# EAGLE design 2mm-2.5mm (EAGLE 4.16)
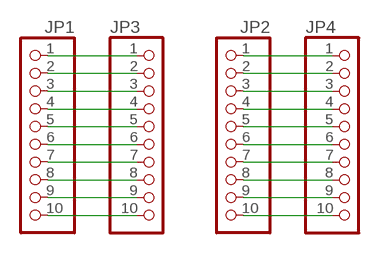
[diagram p0: schematic, sheet 1]

## Parts
JP1  PINHD-1X10  [1X10]
JP2  PINHD-1X10  [1X10]
JP3  PINHD-1X10M  [1X10M]
JP4  PINHD-1X10M  [1X10M]

## Nets
N$1: JP1.1 JP3.1
N$2: JP1.2 JP3.2
N$3: JP1.3 JP3.3
N$4: JP1.4 JP3.4
N$5: JP1.5 JP3.5
N$6: JP1.6 JP3.6
N$7: JP1.7 JP3.7
N$8: JP1.8 JP3.8
N$9: JP1.9 JP3.9
N$10: JP1.10 JP3.10
N$11: JP2.1 JP4.1
N$12: JP2.2 JP4.2
N$13: JP2.3 JP4.3
N$14: JP2.4 JP4.4
N$15: JP2.5 JP4.5
N$16: JP2.6 JP4.6
N$17: JP2.7 JP4.7
N$18: JP2.8 JP4.8
N$19: JP2.9 JP4.9
N$20: JP2.10 JP4.10

## Library data of the parts
JP1 JP2 = pinhead:PINHD-1X10: PIN HEADER
JP3 JP4 = pinhead-new:PINHD-1X10: PIN HEADER

## Board
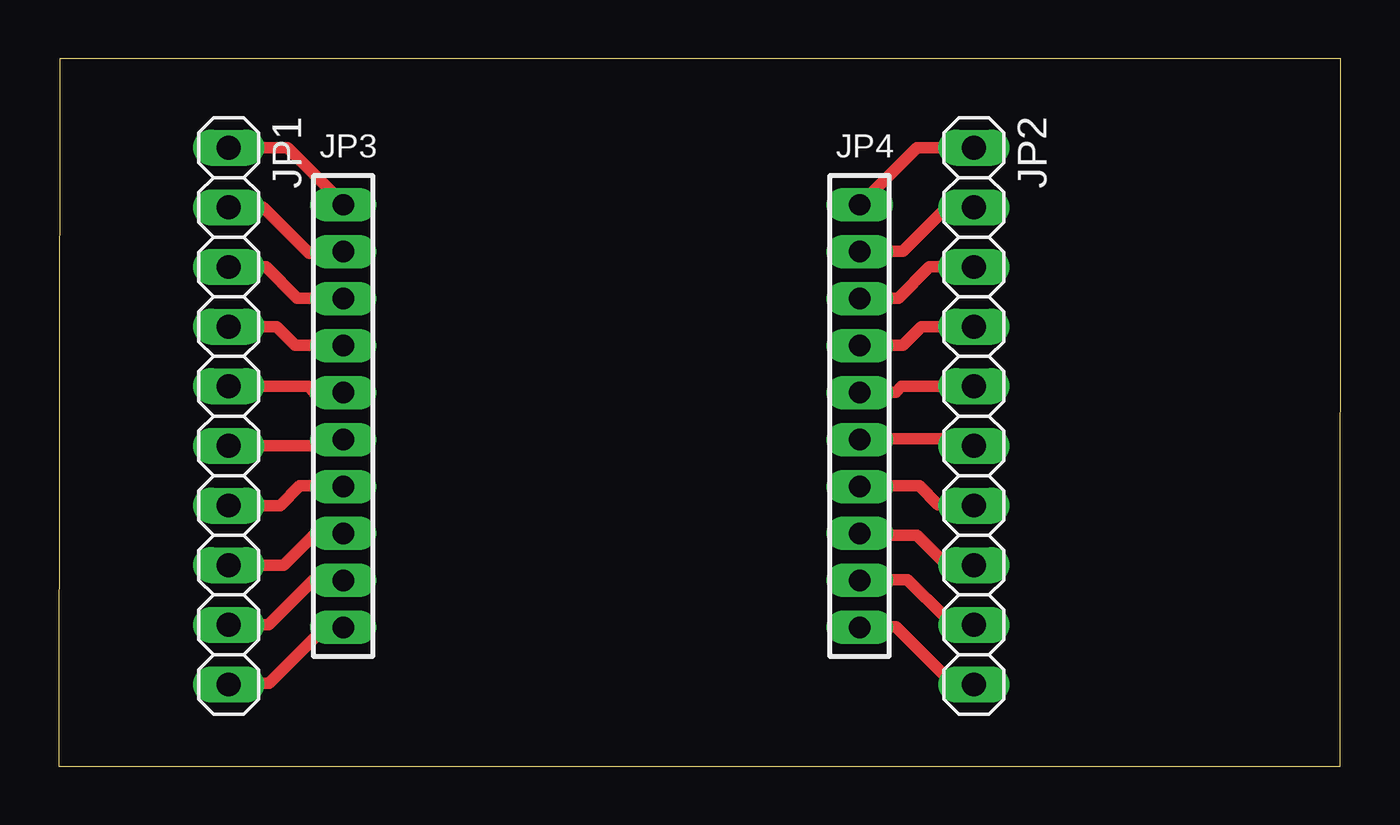
[diagram p1: board, top side]

Size 54.62 x 30.12 mm. Coordinates in mm from the lower left corner, seen from the top.
Outline: 0,0 54.6,0 54.62,30.12 0.05,30.12 0,0
Copper layers (1*16): Top 0.035mm / dielectric 1.5mm / Bottom 0.035mm
Design rules "default": minimum track width 10mil, minimum drill 24mil, track to track 8mil, track to pad 8mil, pad to pad 8mil, via to via 8mil, smd to smd 8mil, copper to edge 40mil, drill to drill 8mil, minimum pad ring 10mil, minimum via ring 8mil, stop-mask expansion 4mil, vias tented up to drill 0mil, thermal gap 10mil

### Footprints (pad centres in the part's own frame; a part is rotated, then mirrored left to right if it is on the bottom)
1X10 = drill 1.016 long: 1 -11.43,0; 2 -8.89,0; 3 -6.35,0; 4 -3.81,0; 5 -1.27,0; 6 1.27,0; 7 3.81,0; 8 6.35,0; 9 8.89,0; 10 11.43,0
1X10M = drill 0.914 long: 1 -9,0; 2 -7,0; 3 -5,0; 4 -3,0; 5 -1,0; 6 1,0; 7 3,0; 8 5,0; 9 7,0; 10 9,0

### Placement (x,y rotation side)
JP1  7.25,14.91 270 top
JP2  38.99,14.91 270 top
JP3  12.12,14.91 270 top
JP4  34.12,14.91 270 top

### Tracks (layer width: path | path; a pad name or v marks a point on that pad's centre or on a via)
N$1
  Top 0.4: 12.17,23.93 12.15,23.9 JP3.1
  Top 0.5: JP1.1 9.77,26.33 12.17,23.93
N$2
  Top 0.4: JP3.2 12.1,21.9 12.07,21.93 11.97,21.83
  Top 0.5: JP1.2 8.71,23.79 10.67,21.83 11.97,21.83
N$3
  Top 0.4: 12.27,19.83 12.2,19.9 | 12.2,19.9 JP3.3 | 12.17,19.93 12.2,19.9
  Top 0.5: JP1.3 8.85,21.25 10.17,19.93 12.17,19.93
N$4
  Top 0.4: 12.07,17.93 12.1,17.9 JP3.4
  Top 0.5: JP1.4 9.29,18.71 10.07,17.93 12.07,17.93
N$5
  Top 0.4: 12.07,15.93 12.1,15.91 JP3.5
  Top 0.5: JP1.5 10.62,16.18 10.87,15.93 12.07,15.93
N$6
  Top 0.4: 12.17,14.03 12.12,13.98 JP3.6
  Top 0.5: JP1.6 11.78,13.64 12.12,13.98
N$7
  Top 0.4: 12.17,11.93 12.15,11.91 JP3.7
  Top 0.5: JP1.7 9.44,11.1 10.27,11.93 12.17,11.93
N$8
  Top 0.4: 12.17,9.83 12.12,9.88 | 12.12,9.88 JP3.8 | 12.07,9.93 12.12,9.88
  Top 0.5: JP1.8 9.6,8.55 10.97,9.93 12.07,9.93
N$9
  Top 0.4: 12.17,7.83 12.12,7.88 | 12.12,7.88 JP3.9 | 12.07,7.93 12.12,7.88
  Top 0.5: JP1.9 8.96,6.01 10.87,7.93 12.07,7.93
N$10
  Top 0.4: 7.27,3.53 7.25,3.5 JP1.10
  Top 0.5: JP3.10 11.35,5.91 8.97,3.53 7.27,3.53
N$11
  Top 0.4: 34.14,23.9 JP4.1
  Top 0.5: JP2.1 36.57,26.33 34.14,23.9
N$12
  Top 0.4: 33.97,21.93 33.99,21.9 JP4.2
  Top 0.5: JP2.2 37.84,23.79 35.97,21.93 33.97,21.93
N$13
  Top 0.4: 34.07,19.83 34.12,19.88 | 34.12,19.88 JP4.3 | 34.17,19.93 34.12,19.88
  Top 0.5: JP2.3 37.09,21.25 35.77,19.93 34.17,19.93
N$14
  Top 0.4: 34.27,17.93 34.24,17.9 JP4.4
  Top 0.5: JP2.4 36.75,18.71 35.97,17.93 34.27,17.93
N$15
  Top 0.4: JP4.5 34.2,15.91 34.27,15.83 34.37,15.93
  Top 0.5: JP2.5 35.91,16.18 35.67,15.93 34.37,15.93
N$16
  Top 0.4: 34.07,13.93 34.09,13.93 JP4.6
  Top 0.5: JP2.6 38.7,13.93 34.09,13.93
N$17
  Top 0.4: JP2.7 38.96,11.13 | 34.14,11.93 JP4.7
  Top 0.5: 38.96,11.13 37.47,11.13 36.67,11.93 34.14,11.93
N$18
  Top 0.4: 34.07,9.83 34.07,9.86 JP4.8
  Top 0.5: JP2.8 38.82,8.73 37.67,8.73 36.57,9.83 34.07,9.83
N$19
  Top 0.4: 34.14,7.93 JP4.9
  Top 0.5: JP2.9 38.68,6.33 37.77,6.33 36.17,7.93 34.14,7.93
N$20
  Top 0.4: JP2.10 38.74,3.73 | 34.07,5.93 34.09,5.93 JP4.10
  Top 0.5: 38.74,3.73 37.87,3.73 35.67,5.93 34.09,5.93